# Altium schematic sheet PowerOutputsAssembly.SchDoc: Power Outputs Assembly
size 292 x 193 mm; CheckedBy: Jakub Howors; Author: Łukasz Gójski; CompanyName: Politechnika Warszawska; Organization: EITI; Address1: Nowowiejska 15/19; Address2: 00-665 Warszawa; SheetNumber: 10; SheetTotal: 13; HTTPLink: www.pw.edu.pl
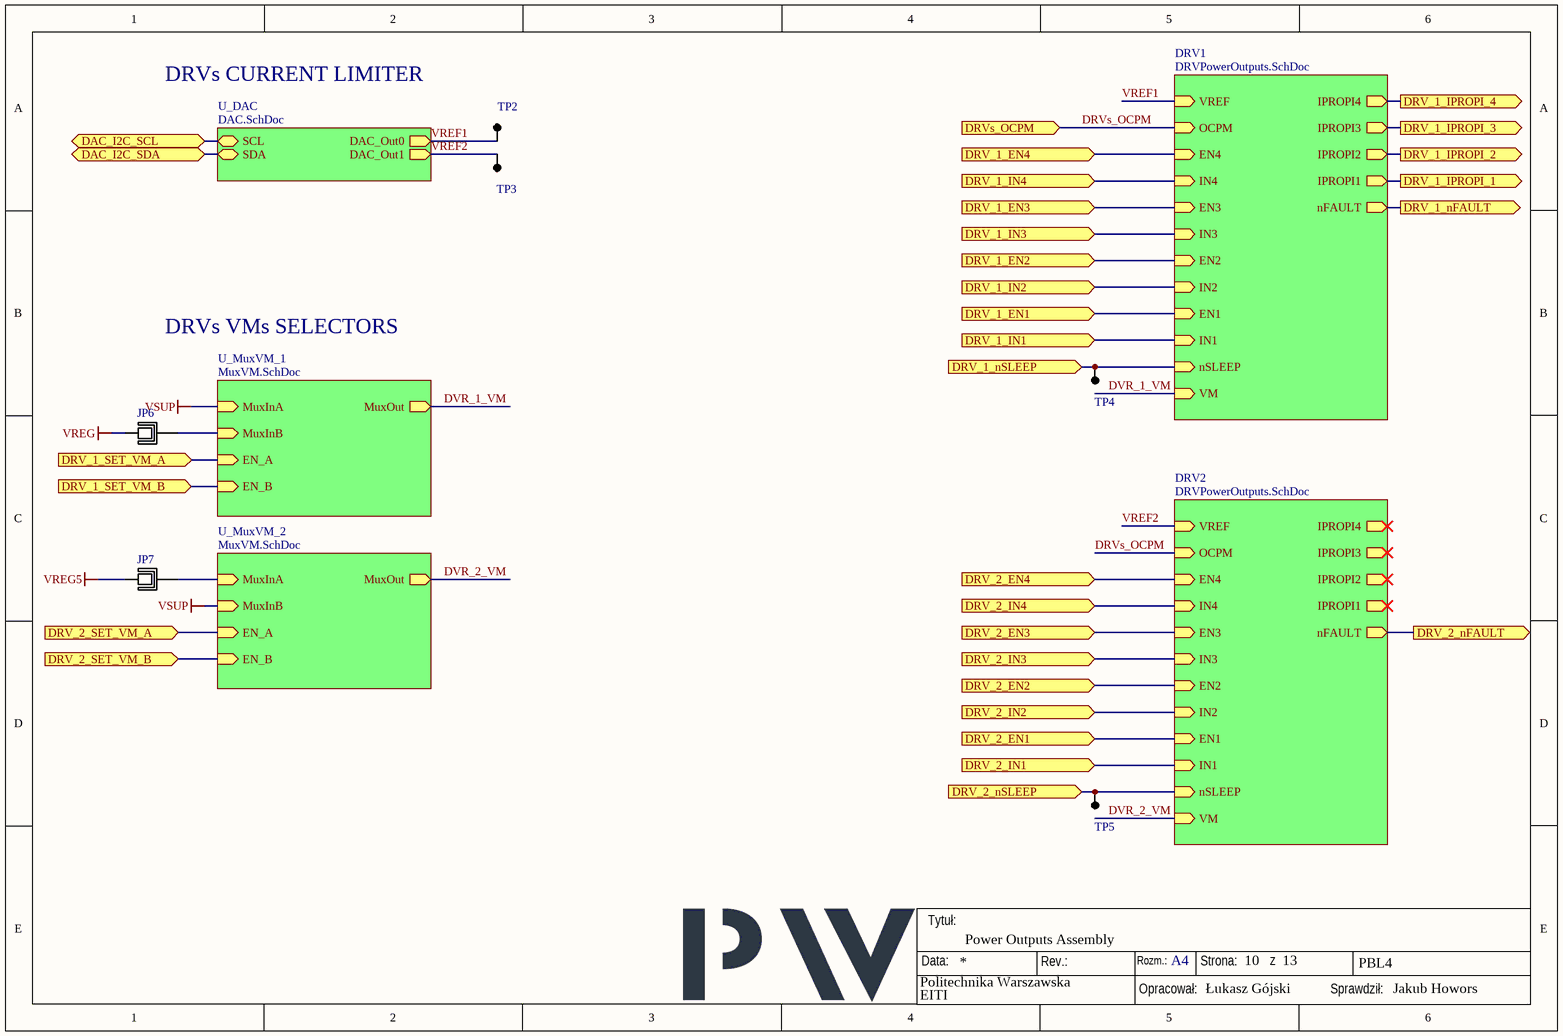
[diagram p0: PowerOutputsAssembly.SchDoc]

## Parts
JP6  JUMPER  [Jumper]  (value not drawn)
JP7  JUMPER  [Jumper]  (value not drawn)
TP2  TP  [TP]  (value not drawn)
TP3  TP  [TP]  (value not drawn)
TP4  TP  [TP]  (value not drawn)
TP5  TP  [TP]  (value not drawn)

## Sub-sheets
DRV1 = DRVPowerOutputs.SchDoc: VREF (in), OCPM (in), IPROPI4 (out), IPROPI3 (out), IPROPI2 (out), IPROPI1 (out), EN4 (in), IN4 (in), EN3 (in), IN3 (in), EN2 (in), IN2 (in), EN1 (in), IN1 (in), nSLEEP (in), nFAULT (out), VM (in)
DRV2 = DRVPowerOutputs.SchDoc: VREF (in), OCPM (in), IPROPI4 (out), IPROPI3 (out), IPROPI2 (out), IPROPI1 (out), EN4 (in), IN4 (in), EN3 (in), IN3 (in), EN2 (in), IN2 (in), EN1 (in), IN1 (in), nSLEEP (in), nFAULT (out), VM (in)
U_DAC = DAC.SchDoc: DAC_Out0 (out), DAC_Out1 (out), SCL (bidir), SDA (bidir)
U_MuxVM_1 = MuxVM.SchDoc: MuxOut (out), MuxInA (in), MuxInB (in), EN_A (in), EN_B (in)
U_MuxVM_2 = MuxVM.SchDoc: MuxOut (out), MuxInA (in), MuxInB (in), EN_A (in), EN_B (in)

## Ports
DAC_I2C_SCL (bidir, see MainAssembly[5C]), DAC_I2C_SDA (bidir, see MainAssembly[5C]), DRV_1_EN1 (in, see MainAssembly[5B]), DRV_1_EN2 (in, see MainAssembly[5B]), DRV_1_EN3 (in, see MainAssembly[5A]), DRV_1_EN4 (in, see MainAssembly[5A]), DRV_1_IN1 (in, see MainAssembly[5B]), DRV_1_IN2 (in, see MainAssembly[5B]), DRV_1_IN3 (in, see MainAssembly[5B]), DRV_1_IN4 (in, see MainAssembly[5A]), DRV_1_IPROPI_1 (out, see MainAssembly[6A]), DRV_1_IPROPI_2 (out, see MainAssembly[6A]), DRV_1_IPROPI_3 (out, see MainAssembly[6A]), DRV_1_IPROPI_4 (out, see MainAssembly[6A]), DRV_1_nFAULT (out, see MainAssembly[6A]), DRV_1_nSLEEP (in, see MainAssembly[5B]), DRV_1_SET_VM_A (in, see MainAssembly[5A]), DRV_1_SET_VM_B (in, see MainAssembly[5A]), DRV_2_EN1 (in, see MainAssembly[5B]), DRV_2_EN2 (in, see MainAssembly[5B]), DRV_2_EN3 (in, see MainAssembly[5B]), DRV_2_EN4 (in, see MainAssembly[5B]), DRV_2_IN1 (in, see MainAssembly[5B]), DRV_2_IN2 (in, see MainAssembly[5B]), DRV_2_IN3 (in, see MainAssembly[5B]), DRV_2_IN4 (in, see MainAssembly[5B]), DRV_2_nFAULT (out, see MainAssembly[6A]), DRV_2_nSLEEP (in, see MainAssembly[5B]), DRV_2_SET_VM_A (in, see MainAssembly[5A]), DRV_2_SET_VM_B (in, see MainAssembly[5A]), DRVs_OCPM (in, see MainAssembly[5A])

## Nets
VREG: JP6.1
VREG5: JP7.1
VSUP: sheet U_MuxVM_1/MuxInA, sheet U_MuxVM_2/MuxInB
DAC_I2C_SCL: port DAC_I2C_SCL, sheet U_DAC/SCL
DAC_I2C_SDA: port DAC_I2C_SDA, sheet U_DAC/SDA
DRV_1_EN1: port DRV_1_EN1, sheet DRV1/EN1
DRV_1_EN2: port DRV_1_EN2, sheet DRV1/EN2
DRV_1_EN3: port DRV_1_EN3, sheet DRV1/EN3
DRV_1_EN4: port DRV_1_EN4, sheet DRV1/EN4
DRV_1_IN1: port DRV_1_IN1, sheet DRV1/IN1
DRV_1_IN2: port DRV_1_IN2, sheet DRV1/IN2
DRV_1_IN3: port DRV_1_IN3, sheet DRV1/IN3
DRV_1_IN4: port DRV_1_IN4, sheet DRV1/IN4
DRV_1_IPROPI_1: port DRV_1_IPROPI_1, sheet DRV1/IPROPI1
DRV_1_IPROPI_2: port DRV_1_IPROPI_2, sheet DRV1/IPROPI2
DRV_1_IPROPI_3: port DRV_1_IPROPI_3, sheet DRV1/IPROPI3
DRV_1_IPROPI_4: port DRV_1_IPROPI_4, sheet DRV1/IPROPI4
DRV_1_nFAULT: port DRV_1_nFAULT, sheet DRV1/nFAULT
DRV_1_nSLEEP: TP4.1(TP) ; port DRV_1_nSLEEP, sheet DRV1/nSLEEP
DRV_1_SET_VM_A: port DRV_1_SET_VM_A, sheet U_MuxVM_1/EN_A
DRV_1_SET_VM_B: port DRV_1_SET_VM_B, sheet U_MuxVM_1/EN_B
DRV_2_EN1: port DRV_2_EN1, sheet DRV2/EN1
DRV_2_EN2: port DRV_2_EN2, sheet DRV2/EN2
DRV_2_EN3: port DRV_2_EN3, sheet DRV2/EN3
DRV_2_EN4: port DRV_2_EN4, sheet DRV2/EN4
DRV_2_IN1: port DRV_2_IN1, sheet DRV2/IN1
DRV_2_IN2: port DRV_2_IN2, sheet DRV2/IN2
DRV_2_IN3: port DRV_2_IN3, sheet DRV2/IN3
DRV_2_IN4: port DRV_2_IN4, sheet DRV2/IN4
DRV_2_nFAULT: port DRV_2_nFAULT, sheet DRV2/nFAULT
DRV_2_nSLEEP: TP5.1(TP) ; port DRV_2_nSLEEP, sheet DRV2/nSLEEP
DRV_2_SET_VM_A: port DRV_2_SET_VM_A, sheet U_MuxVM_2/EN_A
DRV_2_SET_VM_B: port DRV_2_SET_VM_B, sheet U_MuxVM_2/EN_B
DRVs_OCPM: port DRVs_OCPM, sheet DRV1/OCPM, sheet DRV2/OCPM
DVR_1_VM: sheet U_MuxVM_1/MuxOut, sheet DRV1/VM
DVR_2_VM: sheet U_MuxVM_2/MuxOut, sheet DRV2/VM
VREF1: TP2.1(TP) ; sheet DRV1/VREF, sheet U_DAC/DAC_Out0
VREF2: TP3.1(TP) ; sheet DRV2/VREF, sheet U_DAC/DAC_Out1
NetJP6_2: JP6.2 ; sheet U_MuxVM_1/MuxInB
NetJP7_2: JP7.2 ; sheet U_MuxVM_2/MuxInA

## Notes on the sheet
- DRVs CURRENT LIMITER
- DRVs VMs SELECTORS
- Data:
- Tytuł:
- Rev.:
- Rozm.:
- A4
- Strona:
- z
- PBL4
- Opracował:
- Sprawdził:

## Library data of the parts
JP6 JP7 = Jumper x2: Jumper on traces